# Altium schematic sheet LowVoltageBox.SchDoc
size A1
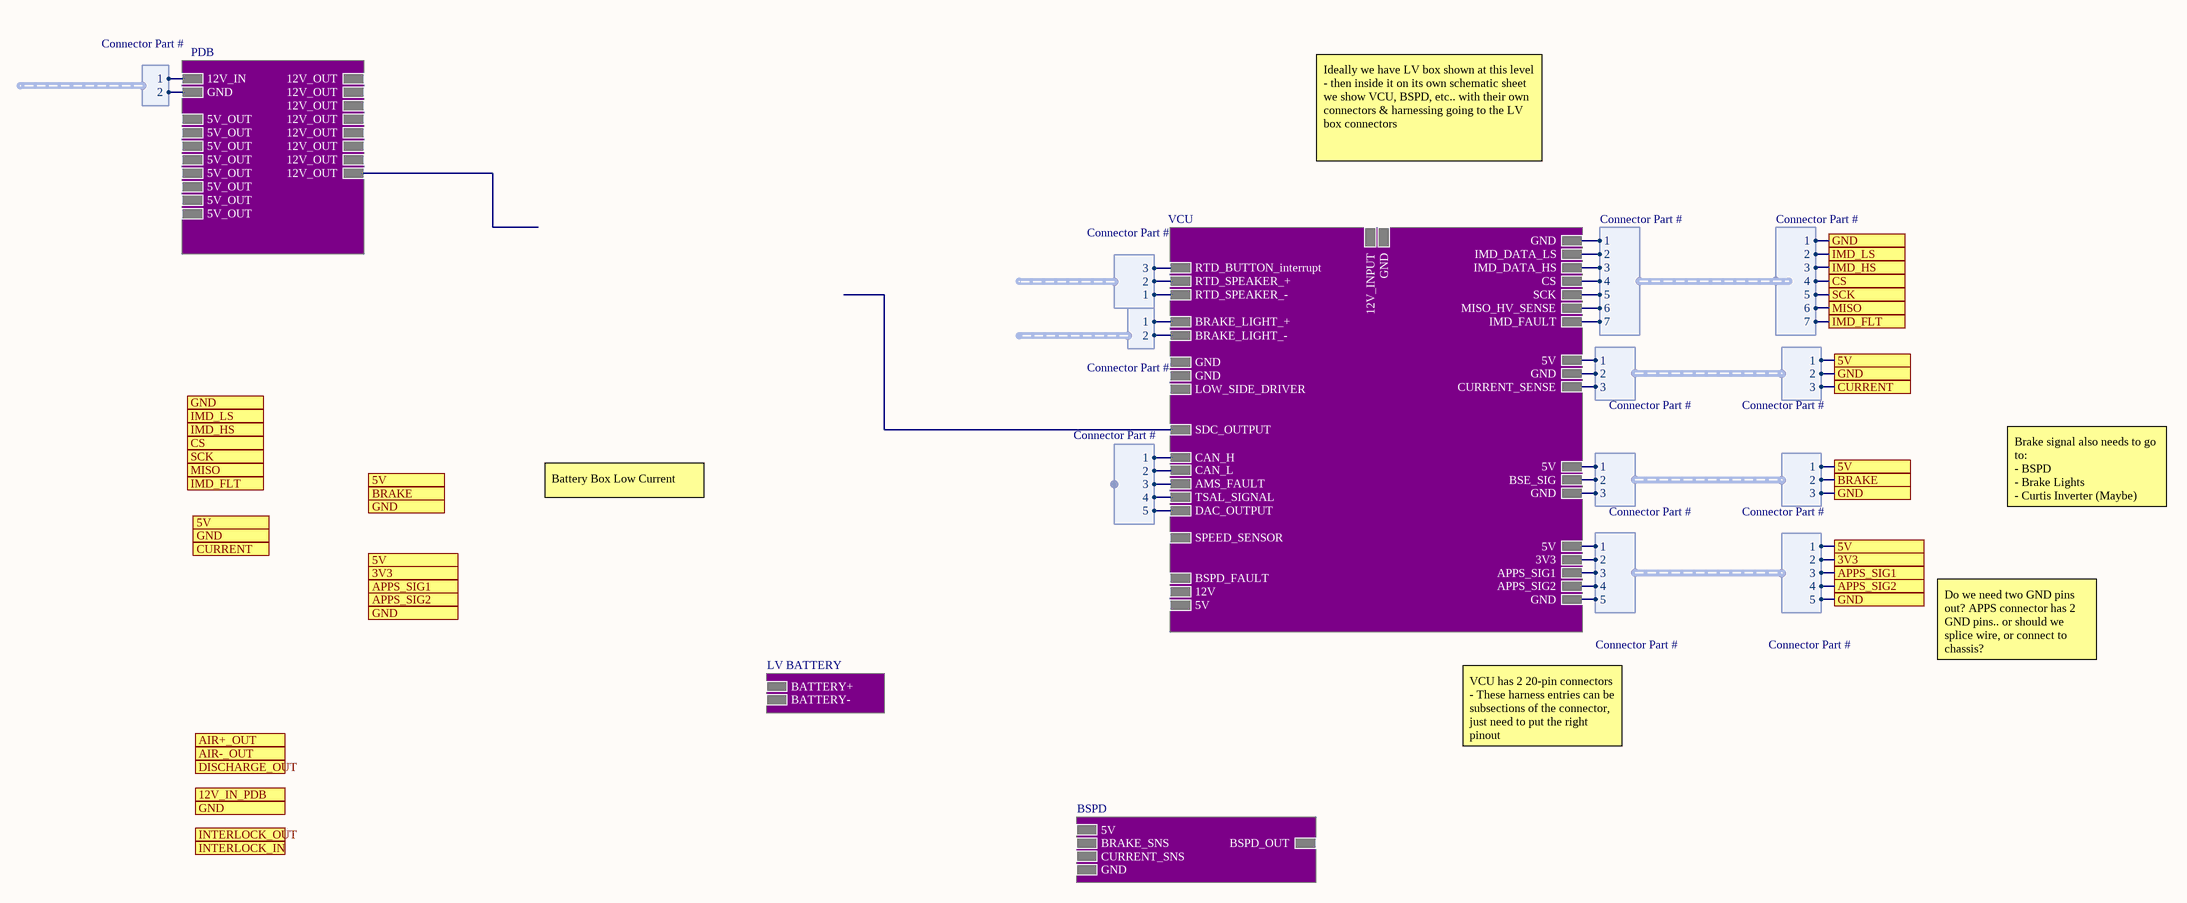
[diagram p0: LowVoltageBox.SchDoc]

## Sub-sheets
BSPD = ?: GND, BRAKE_SNS, CURRENT_SNS, 5V, BSPD_OUT
LV BATTERY = ?: BATTERY-, BATTERY+
PDB = ?: 12V_IN, GND, 12V_OUT, 12V_OUT, 12V_OUT, 12V_OUT, 12V_OUT, 12V_OUT, 12V_OUT, 5V_OUT, 5V_OUT, 5V_OUT, 5V_OUT, 5V_OUT, 12V_OUT, 5V_OUT, 5V_OUT, 5V_OUT
VCU = ?: BRAKE_LIGHT_+, BRAKE_LIGHT_-, 5V, 12V, GND, LOW_SIDE_DRIVER, TSAL_SIGNAL, CAN_H, CAN_L, DAC_OUTPUT, SDC_OUTPUT, BSPD_FAULT, AMS_FAULT, IMD_FAULT, IMD_DATA_LS, CS, SCK, MISO_HV_SENSE, GND, CURRENT_SENSE, 5V, IMD_DATA_HS, GND, RTD_SPEAKER_+, RTD_BUTTON_interrupt, 5V, GND, BSE_SIG, 3V3, GND, 5V, APPS_SIG2, APPS_SIG1, 12V_INPUT, GND, RTD_SPEAKER_-, GND, SPEED_SENSOR

## Ports
3V3 (harness Connector Part #), 5V (harness Connector Part #), 12V_IN_PDB (harness Connector Part #), AIR+_OUT (harness Connector Part #), AIR-_OUT (harness Connector Part #), APPS_SIG1 (harness Connector Part #), APPS_SIG2 (harness Connector Part #), BRAKE (harness Connector Part #), CS (harness Connector Part #), CURRENT (harness Connector Part #), DISCHARGE_OUT (harness Connector Part #), GND (harness Connector Part #), IMD_FLT (harness Connector Part #), IMD_HS (harness Connector Part #), IMD_LS (harness Connector Part #), INTERLOCK_IN (harness Connector Part #), INTERLOCK_OUT (harness Connector Part #), MISO (harness Connector Part #), SCK (harness Connector Part #)

## Harnesses
Connector Part #: 1, 2, 3, 4, 5
Connector Part #: 5, 4, 3, 2, 1
Connector Part #: 1, 2, 3
Connector Part #: 3, 2, 1
Connector Part #: 1, 2, 3, 4, 5, 6, 7
Connector Part #: 7, 6, 5, 4, 3, 2, 1
Connector Part #: 1, 2

## Nets
(unnamed): sheet VCU/BRAKE_LIGHT_+, harness Connector Part #.1
(unnamed): sheet VCU/BRAKE_LIGHT_-, harness Connector Part #.2
(unnamed): sheet VCU/TSAL_SIGNAL, harness Connector Part #.4
(unnamed): sheet VCU/CAN_H, harness Connector Part #.1
(unnamed): sheet VCU/CAN_L, harness Connector Part #.2
(unnamed): sheet VCU/DAC_OUTPUT, harness Connector Part #.5
(unnamed): sheet VCU/AMS_FAULT, harness Connector Part #.3
(unnamed): sheet VCU/IMD_FAULT, harness Connector Part #.7
(unnamed): sheet VCU/IMD_DATA_LS, harness Connector Part #.2
(unnamed): sheet VCU/CS, harness Connector Part #.4
(unnamed): sheet VCU/SCK, harness Connector Part #.5
(unnamed): sheet VCU/MISO_HV_SENSE, harness Connector Part #.6
(unnamed): sheet VCU/GND, harness Connector Part #.1
(unnamed): sheet VCU/CURRENT_SENSE, harness Connector Part #.3
(unnamed): sheet VCU/5V, harness Connector Part #.1
(unnamed): sheet VCU/IMD_DATA_HS, harness Connector Part #.3
(unnamed): sheet VCU/GND, harness Connector Part #.2
(unnamed): sheet VCU/RTD_SPEAKER_+, harness Connector Part #.2
(unnamed): sheet VCU/RTD_BUTTON_interrupt, harness Connector Part #.3
(unnamed): sheet VCU/5V, harness Connector Part #.1
(unnamed): sheet VCU/GND, harness Connector Part #.3
(unnamed): sheet VCU/BSE_SIG, harness Connector Part #.2
(unnamed): sheet VCU/3V3, harness Connector Part #.2
(unnamed): sheet VCU/GND, harness Connector Part #.5
(unnamed): sheet VCU/5V, harness Connector Part #.1
(unnamed): sheet VCU/APPS_SIG2, harness Connector Part #.4
(unnamed): sheet VCU/APPS_SIG1, harness Connector Part #.3
(unnamed): sheet VCU/RTD_SPEAKER_-, harness Connector Part #.1
(unnamed): sheet PDB/12V_IN, harness Connector Part #.1
(unnamed): sheet PDB/GND, harness Connector Part #.2

## Notes on the sheet
- Ideally we have LV box shown at this level
  - then inside it on its own schematic sheet we show VCU, BSPD, etc.. with their own connectors & harnessing going to the LV box connectors
- Battery Box Low Current
- Brake signal also needs to go to:
  - BSPD
  - Brake Lights
  - Curtis Inverter (Maybe)
- Do we need two GND pins out? APPS connector has 2 GND pins.. or should we splice wire, or connect to chassis?
- VCU has 2 20-pin connectors
  - These harness entries can be subsections of the connector, just need to put the right pinout